# Altium schematic sheet [05] - CONNECTORS.SchDoc
size A3; DocumentNumber: 5; SheetNumber: 5; SheetTotal: 7
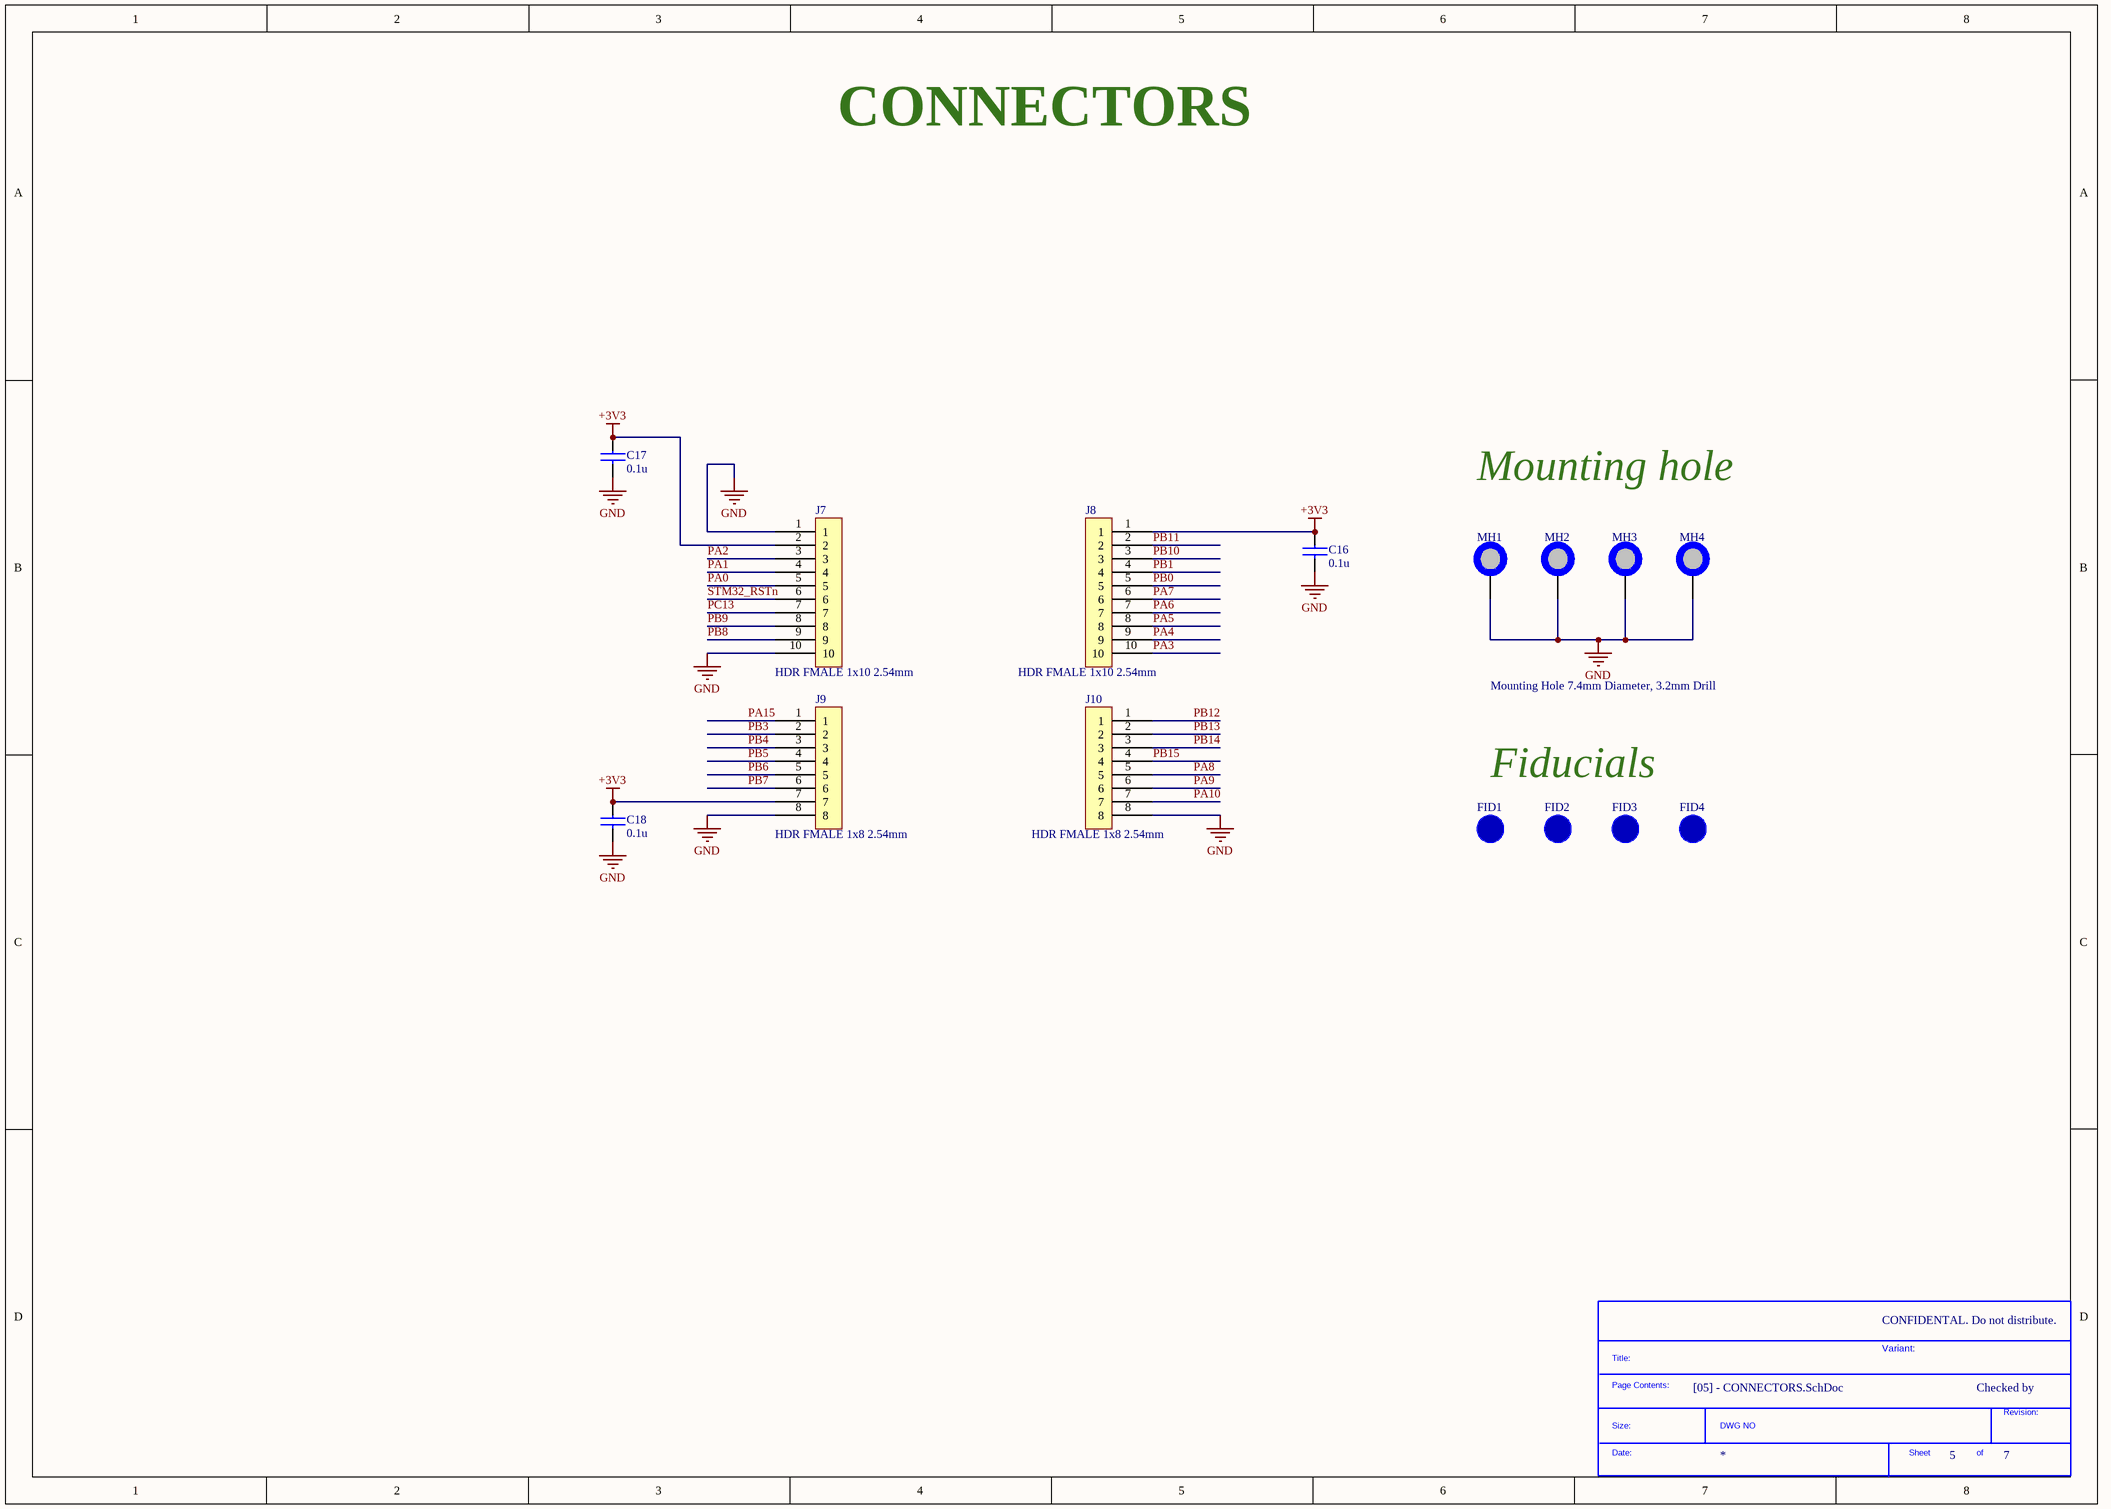
[diagram p0: [05] - CONNECTORS.SchDoc]

## Parts
*  SDTitleBlock  (value not drawn)  (graphical)
C16  0.1u  [C0805]
C17  0.1u  [C0805]
C18  0.1u  [C0805]
FID1  FID_1MMC  [FID_40X120D]  (value not drawn)
FID2  FID_1MMC  [FID_40X120D]  (value not drawn)
FID3  FID_1MMC  [FID_40X120D]  (value not drawn)
FID4  FID_1MMC  [FID_40X120D]  (value not drawn)
J7  HDR FMALE 1x10 2.54mm  [Hdr_Female_1x10_2.54mm]
J8  HDR FMALE 1x10 2.54mm  [Hdr_Female_1x10_2.54mm]
J9  HDR FMALE 1x8 2.54mm  [Hdr_Female_1x8_2.54mm]
J10  HDR FMALE 1x8 2.54mm  [Hdr_Female_1x8_2.54mm]
MH1  Mounting Hole 7.4mm Diameter, 3.2mm Drill  [MH_7.4MMD_3.2MMD]  (no BOM)
MH2  Mounting Hole 7.4mm Diameter, 3.2mm Drill  [MH_7.4MMD_3.2MMD]  (value not drawn)  (no BOM)
MH3  Mounting Hole 7.4mm Diameter, 3.2mm Drill  [MH_7.4MMD_3.2MMD]  (value not drawn)  (no BOM)
MH4  Mounting Hole 7.4mm Diameter, 3.2mm Drill  [MH_7.4MMD_3.2MMD]  (value not drawn)  (no BOM)

## Nets
+3V3: C16.1 C17.1 C18.1 J7.2 J8.1 J9.7
GND: C16.2 C17.2 C18.2 J7.1 J7.10 J9.8 J10.8 MH1.1 MH2.1 MH3.1 MH4.1
PA0: J7.5
PA1: J7.4
PA2: J7.3
PA3: J8.10
PA4: J8.9
PA5: J8.8
PA6: J8.7
PA7: J8.6
PA8: J10.5
PA9: J10.6
PA10: J10.7
PA15: J9.1
PB0: J8.5
PB1: J8.4
PB3: J9.2
PB4: J9.3
PB5: J9.4
PB6: J9.5
PB7: J9.6
PB8: J7.9
PB9: J7.8
PB10: J8.3
PB11: J8.2
PB12: J10.1
PB13: J10.2
PB14: J10.3
PB15: J10.4
PC13: J7.7
STM32_RSTn: J7.6

## Notes on the sheet
- CONNECTORS
- Mounting hole
- Fiducials
- CONFIDENTAL. Do not distribute.
- CLOCKS (CPU & PCIE)
- Variant:
- Checked by
- (in symbol SDTitleBlock) Title:; Page Contents:; Revision:; Size:; DWG NO; Date:; Sheet; of

## Library data of the parts
C16-C18 = C2012X7R1H104K085AA: CAP CER 0.1UF 50V 10% X7R 0805; Manufacturer: TDK; Dielectric Material: Ceramic; Capacitance: 100nF; Supplier 1: Digi-Key; Manufacturer Part Number: C2012X7R1H104K085AA; Stock 1: 151003; Pricing 1: 1 = 0.17000, 10 = 0.11900, 100 = 0.05610, 500 = 0.03936, 1000 = 0.03258 (USD); RoHS: Yes; Mount: Surface Mount; Case/Package: 0805; Number of Pins: 2; Weight: 0.000194oz; Case Code (Metric): 2012; Case Code (Imperial): 0805; Min Operating Temperature: -55°C; Max Operating Temperature: 125°C; Tolerance: 10%; Dielectric: X7R; Termination: SMD/SMT; Voltage Rating: 50V; Packaging: Tape and Reel; Voltage Rating (DC): 50V; Composition: Ceramic; Voltage: 50V; Package Quantity: 1; Length: 2mm; Height: 0.85mm; Depth: 1.25mm; Thickness: 0.037inch; Width: 0.049inch; Radiation Hardening: No; Lead Free: Lead Free; REACH SVHC: No SVHC; ComponentLink1URL: https://datasheet.ciiva.com/11788/0900766b80c1bb00-11788128.pdf?src-supplier=RSComponents; ComponentLink1Description: https://datasheet.ciiva.com/11788/0900766b80c1bb00-11788128.pdf?src-supplier=RSComponents; ComponentLink2URL: https://datasheet.ciiva.com/6250/tdkmlcccaprange-6250821.pdf?src-supplier=Digi-Key; ComponentLink2Description: https://datasheet.ciiva.com/6250/tdkmlcccaprange-6250821.pdf?src-supplier=Digi-Key; ComponentLink3URL: https://datasheet.ciiva.com/24191/e412-c-24191447.pdf?src-supplier=Future+Electronics; ComponentLink3Description: https://datasheet.ciiva.com/24191/e412-c-24191447.pdf?src-supplier=Future+Electronics; ComponentLink4URL: https://datasheet.ciiva.com/6250/tdkmlcccaprange-6250824.pdf?src-supplier=Digi-Key; ComponentLink4Description: https://datasheet.ciiva.com/6250/tdkmlcccaprange-6250824.pdf?src-supplier=Digi-Key; ComponentLink5URL: https://datasheet.ciiva.com/23803/1796654-23803035.pdf?src-supplier=Newark; ComponentLink5Description: https://datasheet.ciiva.com/23803/1796654-23803035.pdf?src-supplier=Newark; ComponentLink6URL: https://datasheet.ciiva.com/28602/1571323-28602204.pdf?src-supplier=Element14; ComponentLink6Description: https://datasheet.ciiva.com/28602/1571323-28602204.pdf?src-supplier=Element14; Supplier Part Number 1: 445-7534-1-ND
FID1-FID4 = FID_1MMC: Fiducial 40mil Diameter, 120mil Mask
J7 J8 = M20-7821046: Manufacturer: Harwin; Number of Contacts: 10; Connector Type: Receptacle,Socket; Gender: Receptacle; Insulation Resistance: 1MR; Max Current Rating: 3A; Contact Resistance: 20mR; Mating Cycles: 50; Hole Diameter: 0.8mm; Supplier 1: Mouser; Manufacturer Part Number: M20-7821046; Stock 1: 412; Pricing 1: 1 = 1.27000, 10 = 1.08000, 100 = 0.93800, 500 = 0.79100, 1000 = 0.70400, 2500 = 0.61500 (USD); RoHS: Yes; Mount: Through Hole; Case/Package: SIL; Housing Color: Black; Color: Black; Contact Plating: Tin; Contact Material: Bronze; Housing Material: Polyamide; Min Operating Temperature: -40°C; Max Operating Temperature: 105°C; Termination: Solder; Number of Rows: 1; Orientation: Straight; Number of Positions: 10; Packaging: Rail/Tube; Contact Gender: Female; Package Quantity: 23; Current Rating: 3A; Length: 25.8mm; Pitch: 2.54mm; Depth: 2.5mm; Lead Pitch: 2.54mm; Radiation Hardening: No; REACH SVHC: No SVHC; ComponentLink1URL: https://datasheet.ciiva.com/26899/getdatasheetpartid-559226-26899379.pdf?src-supplier=Verical; ComponentLink1Description: https://datasheet.ciiva.com/26899/getdatasheetpartid-559226-26899379.pdf?src-supplier=Verical; ComponentLink2URL: https://datasheet.ciiva.com/11753/0900766b80dc1d2b-11753869.pdf?src-supplier=RSComponents; ComponentLink2Description: https://datasheet.ciiva.com/11753/0900766b80dc1d2b-11753869.pdf?src-supplier=RSComponents; ComponentLink3URL: https://datasheet.ciiva.com/6785/m20-782-6785605.pdf?src-supplier=Digi-Key; ComponentLink3Description: https://datasheet.ciiva.com/6785/m20-782-6785605.pdf?src-supplier=Digi-Key; ComponentLink4URL: https://datasheet.ciiva.com/10151/m20-782-10151366.pdf?src-supplier=Avnet; ComponentLink4Description: https://datasheet.ciiva.com/10151/m20-782-10151366.pdf?src-supplier=Avnet; ComponentLink5URL: https://datasheet.ciiva.com/16732/m20-782-16732152.pdf?src-supplier=Avnet+Europe; ComponentLink5Description: https://datasheet.ciiva.com/16732/m20-782-16732152.pdf?src-supplier=Avnet+Europe; Supplier Part Number 1: 855-M20-7821046
J9 J10 = M20-7820842: 08-WAY SIL VERT SOCKET L/FREE; Manufacturer: Harwin; Number of Contacts: 8; Connector Type: Receptacle,Socket; Gender: Female; Max Current Rating: 3A; Contact Resistance: 20mR; Supplier 1: Mouser; Manufacturer Part Number: M20-7820842; Stock 1: 1459; Pricing 1: 1 = 1.10000, 10 = 0.94000, 100 = 0.81200, 500 = 0.68500, 1000 = 0.60900, 2500 = 0.53300 (USD); RoHS: Yes; Mount: Through Hole; Case/Package: SIL; Weight: 0.025397oz; Contact Plating: Tin,Gold; Housing Color: Black; Color: Black; Contact Material: Bronze; Housing Material: Polyamide; Min Operating Temperature: -40°C; Max Operating Temperature: 105°C; Termination: Solder; Number of Rows: 1; Orientation: Straight; Number of Positions: 8; Contact Gender: Female; Package Quantity: 29; Packaging: Rail/Tube; Length: 20.72mm; Pitch: 2.54mm; Depth: 2.5mm; Radiation Hardening: No; ComponentLink1URL: https://datasheet.ciiva.com/16732/m20-782-16732663.pdf?src-supplier=Avnet+Europe; ComponentLink1Description: https://datasheet.ciiva.com/16732/m20-782-16732663.pdf?src-supplier=Avnet+Europe; ComponentLink2URL: https://datasheet.ciiva.com/9480/m20-782-9480074.pdf?src-supplier=Avnet; ComponentLink2Description: https://datasheet.ciiva.com/9480/m20-782-9480074.pdf?src-supplier=Avnet; Supplier Part Number 1: 855-M20-7820842
MH1-MH4 = MH_7.4MMC_3.2MMD